# Altium schematic sheet 驱动.SchDoc: 驱动
size A4; DocumentNumber: 5; Revision: 樊浩柏; SheetNumber: 5; SheetTotal: 6
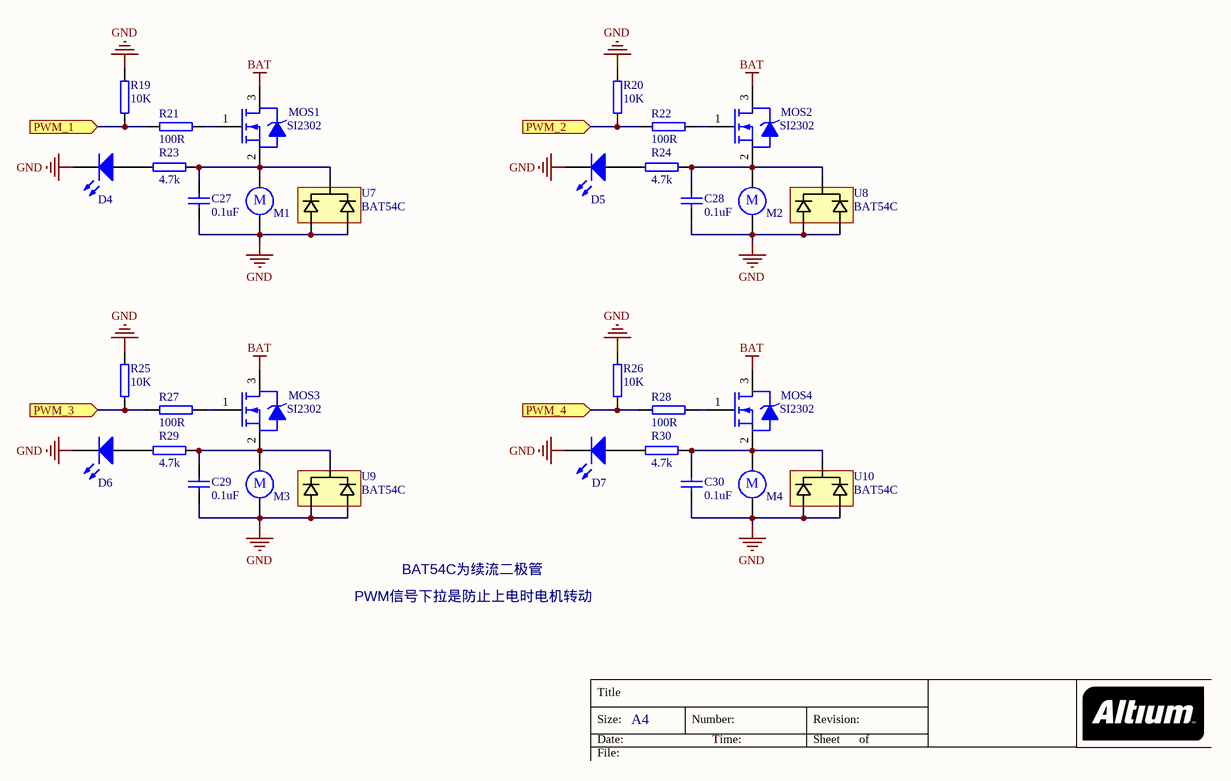
[diagram p0: 驱动.SchDoc]

## Parts
C27  0.1uF  [CAP-0603]
C28  0.1uF  [CAP-0603]
C29  0.1uF  [CAP-0603]
C30  0.1uF  [CAP-0603]
D4  LED  [LED-BLU-0603]  (value not drawn)
D5  LED  [LED-BLU-0603]  (value not drawn)
D6  LED  [LED-BLU-0603]  (value not drawn)
D7  LED  [LED-BLU-0603]  (value not drawn)
M1  Motor  [Header-2.0-SMD]  (value not drawn)
M2  Motor  [Header-2.0-SMD]  (value not drawn)
M3  Motor  [Header-2.0-SMD]  (value not drawn)
M4  Motor  [Header-2.0-SMD]  (value not drawn)
MOS1  SI2302  [SOT-23-3-L]
MOS2  SI2302  [SOT-23-3-L]
MOS3  SI2302  [SOT-23-3-L]
MOS4  SI2302  [SOT-23-3-L]
R19  10K  [RES-0603]
R20  10K  [RES-0603]
R21  100R  [RES-0603]
R22  100R  [RES-0603]
R23  4.7k  [RES-0603]
R24  4.7k  [RES-0603]
R25  10K  [RES-0603]
R26  10K  [RES-0603]
R27  100R  [RES-0603]
R28  100R  [RES-0603]
R29  4.7k  [RES-0603]
R30  4.7k  [RES-0603]
U7  BAT54C  [SOT-23-3-L]
U8  BAT54C  [SOT-23-3-L]
U9  BAT54C  [SOT-23-3-L]
U10  BAT54C  [SOT-23-3-L]

## Ports
PWM_1 (in), PWM_2 (in), PWM_3 (in), PWM_4 (in)

## Nets
BAT: MOS1.3(D) MOS2.3(D) MOS3.3(D) MOS4.3(D)
GND: C27.2 C28.2 C29.2 C30.2 D4.K D5.K D6.K D7.K M1.2 M2.2 M3.2 M4.2 R19.1 R20.1 R25.1 R26.1 U7.1 U7.2 U8.1 U8.2 U9.1 U9.2 U10.1 U10.2
PWM_1: R19.2 R21.1 ; port PWM_1
PWM_2: R20.2 R22.1 ; port PWM_2
PWM_3: R25.2 R27.1 ; port PWM_3
PWM_4: R26.2 R28.1 ; port PWM_4
NetC27_1: C27.1 M1.1 MOS1.2(S) R23.2 U7.3
NetC28_1: C28.1 M2.1 MOS2.2(S) R24.2 U8.3
NetC29_1: C29.1 M3.1 MOS3.2(S) R29.2 U9.3
NetC30_1: C30.1 M4.1 MOS4.2(S) R30.2 U10.3
NetD4_A: D4.A R23.1
NetD5_A: D5.A R24.1
NetD6_A: D6.A R29.1
NetD7_A: D7.A R30.1
NetMOS1_1: MOS1.1(G) R21.2
NetMOS2_1: MOS2.1(G) R22.2
NetMOS3_1: MOS3.1(G) R27.2
NetMOS4_1: MOS4.1(G) R28.2

## Notes on the sheet
- PWM信号下拉是防止上电时电机转动
- BAT54C为续流二极管
- Title
- Size:
- Date:
- A4
- Number:
- Time:
- Revision:
- Sheet
- of
- File:
- (in symbol Motor) M

## Library data of the parts
C27-C30 = Cap
MOS1-MOS4 = N-MOS
R19-R30 = Res
M1-M4 = Motor: Published: 24-Mar-1999; LatestRevisionDate: 17-Jul-2002; LatestRevisionNote: Re-released for DXP Platform.; PackageReference: RB5-10.5; Publisher: Altium Limited; PackageDescription: Capacitor (Radial); 2 Leads